# EAGLE design 201_3axisRev010100 (EAGLE 9.6.2)
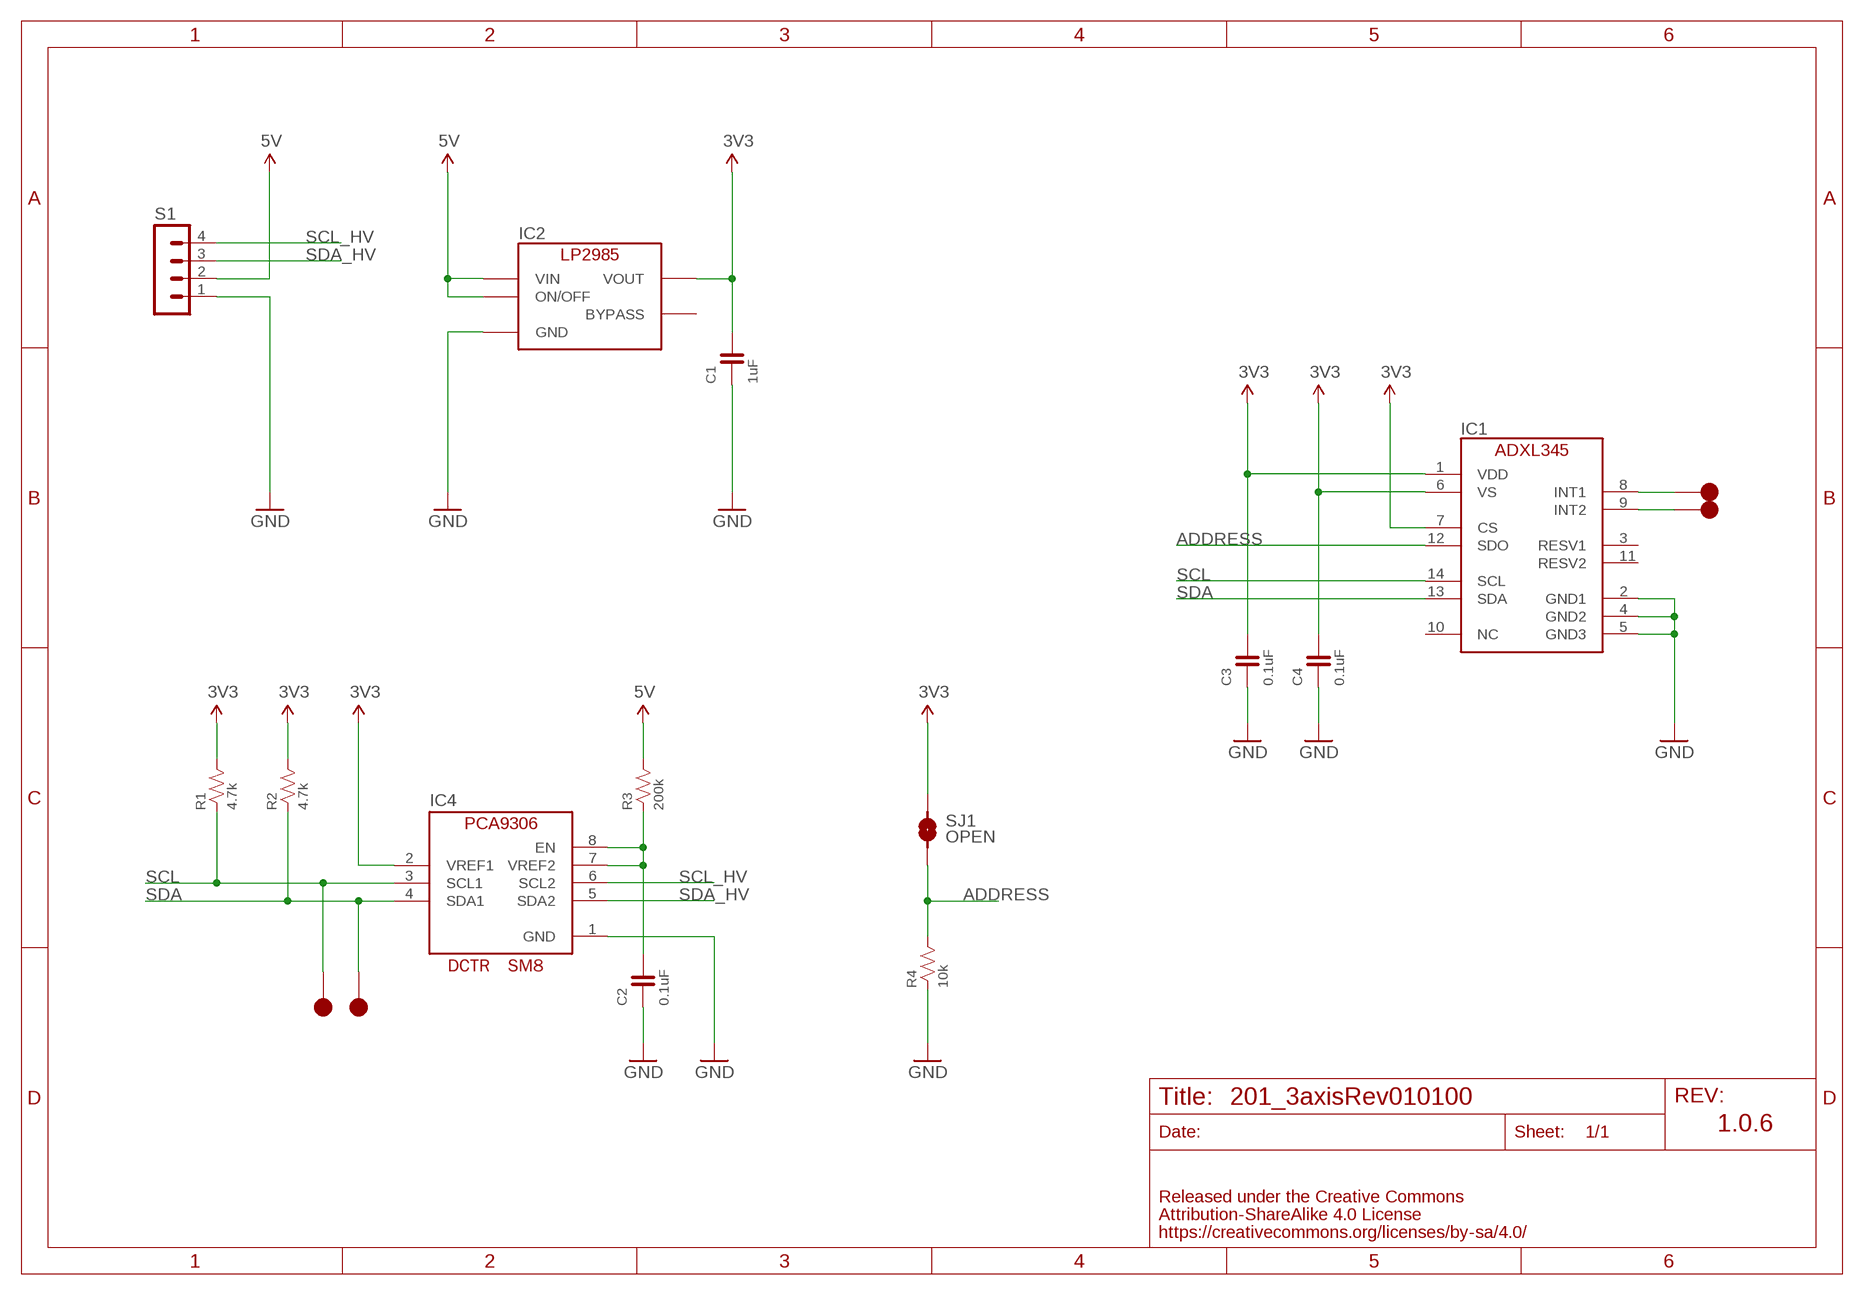
[diagram p0: schematic, sheet 1]

## Parts
C1  1uF  CAPACITOR-0603  [0603]
C2  0.1uF  CAPACITOR-0603  [0603]
C3  0.1uF  CAPACITOR-0603  [0603]
C4  0.1uF  CAPACITOR-0603  [0603]
IC1  AD-ADXL345  [ANALOGDEVICES-ADXL345]
IC2  LP2985-33DBV  [SOT-23-5]
IC4  PCA9306_SSOP  [8PIN-SSOP]
R1  4.7k  RESISTOR-0603  [0603]
R2  4.7k  RESISTOR-0603  [0603]
R3  200k  RESISTOR-0603  [0603]
R4  10k  RESISTOR-0603  [0603]
S1  MA04-1  [MA04-1]
SJ1  OPEN  SMD-JUMPER-2  [SMD-JUMPER-2]
TP1  TP-15  [TP-15]
TP2  TP-15  [TP-15]
TP3  TP-15  [TP-15]
TP4  TP-15  [TP-15]

## Nets
3V3: C1.2 C3.2 C4.2 IC1.1(VDD) IC1.6(VS) IC1.7(CS) IC2.5(VOUT) IC4.2(VREF1) R1.2 R2.2 SJ1.1
5V: IC2.1(VIN) IC2.3(ON/OFF) R3.2 S1.2
ADDRESS: IC1.12(SDO) R4.2 SJ1.2
GND: C1.1 C2.1 C3.1 C4.1 IC1.2(GND1) IC1.4(GND2) IC1.5(GND3) IC2.2(GND) IC4.1(GND) R4.1 S1.1
INT1: IC1.8(INT1) TP3.1
INT2: IC1.9(INT2) TP4.1
N$1: C2.2 IC4.7(VREF2) IC4.8(EN) R3.1
SCL: IC1.14(SCL) IC4.3(SCL1) R1.1 TP2.1
SCL_HV: IC4.6(SCL2) S1.4
SDA: IC1.13(SDA) IC4.4(SDA1) R2.1 TP1.1
SDA_HV: IC4.5(SDA2) S1.3
Unconnected: IC1.3(RESV1) IC1.10(NC) IC1.11(RESV2) IC2.4(BYPASS)

## Notes on the sheet
- DCTR　SM8
- 1.0.6

## Library data of the parts
C1-C4 = FaBo-Capacitor:CAPACITOR: CAPACITOR
IC1 = FaBo-Mems:AD-ADXL345: ANALOGDEVICES ADXL345(3axis)
IC2 = FaBo-Supply:LP2985: LP2985
IC4 = FaBo-LevelTranslator:PCA9306
R1-R4 = FaBo-Resistors:RESISTOR: RESISTOR
S1 = con-lstb:MA04-1: PIN HEADER; OC_FARNELL: unknown; OC_NEWARK: unknown
SJ1 = FaBo-etc:SMD-JUMPER-2
TP1-TP4 = FaBo-Supply:TP

## Board
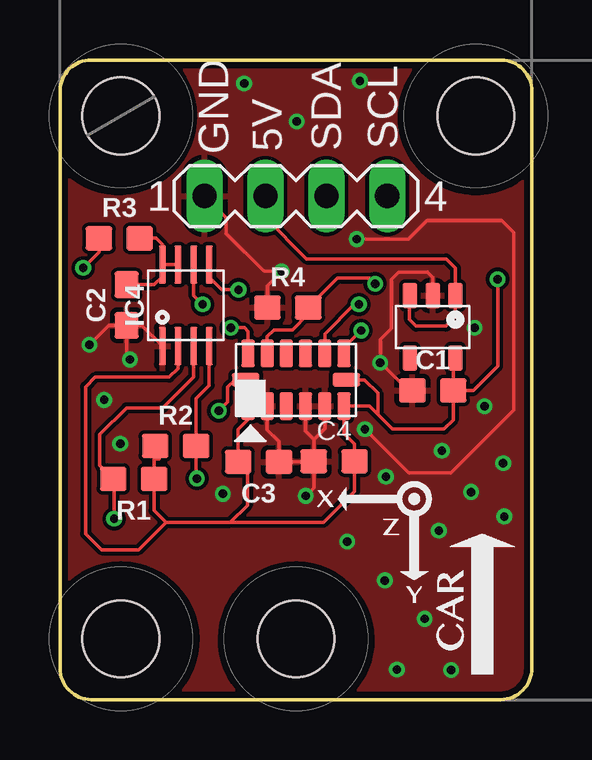
[diagram p1: board, top side]
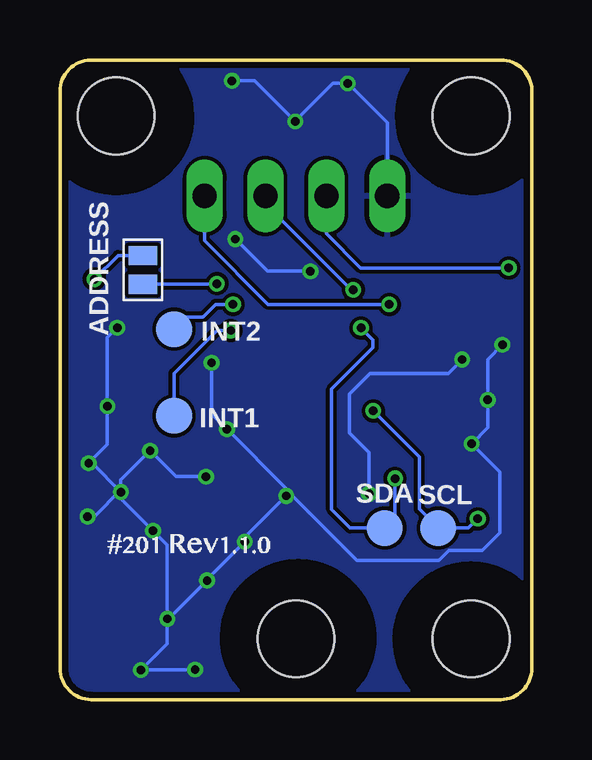
[diagram p2: board, bottom side, seen from below]

Size 19.68 x 26.67 mm. Coordinates in mm from the lower left corner, seen from the top.
Outline: 0,1.3 0,25.4 arc-88 1.3,26.67 18.41,26.67 arc-88 19.68,25.37 19.68,1.3 arc-88 18.39,0 1.3,0 arc-88 0,1.3
Copper layers (1*16): Top 0.035mm / dielectric 1.6mm / Bottom 0.035mm
Design rules "PCBway": minimum track width 6mil, minimum drill 12mil, track to track 6mil, track to pad 6mil, pad to pad 6mil, via to via 6mil, smd to smd 6mil, copper to edge 10mil, drill to drill 10mil, minimum pad ring 10mil, minimum via ring 6mil, stop-mask expansion 2mil, vias tented up to drill 100mil, thermal gap 8mil
Holes 3.2 mm at 2.54,2.54 17.34,24.34 2.54,24.34 9.84,2.54
tRestrict: 4 lines
bRestrict: 4 lines

### Footprints (pad centres in the part's own frame; a part is rotated, then mirrored left to right if it is on the bottom)
0603 = smd 1.1 x 1: 1 -0.85,0; 2 0.85,0
ANALOGDEVICES-ADXL345 = smd 1.145 x 0.55: 1 -1.097,2; 2 -1.097,1.2; 3 -1.097,0.4; 4 -1.097,-0.4; 5 -1.097,-1.2; 6 -1.097,-2; 8 1.097,-2; 9 1.097,-1.2; 10 1.097,-0.4; 11 1.097,0.4; 12 1.097,1.2; 13 1.097,2 | smd 0.55 x 1.145: 7 0,-2.098; 14 0,2.098
SOT-23-5 = smd 0.6 x 1.05: 1 -0.95,-1.3; 2 0,-1.3; 3 0.95,-1.3; 4 0.95,1.3; 5 -0.95,1.3
8PIN-SSOP = smd 0.3 x 1.6: 1 -0.975,-1.7; 2 -0.325,-1.7; 3 0.325,-1.7; 4 0.975,-1.7; 5 0.975,1.7; 6 0.325,1.7; 7 -0.325,1.7; 8 -0.975,1.7
MA04-1 = drill 1.016 long: 1 -3.81,0; 2 -1.27,0; 3 1.27,0; 4 3.81,0
SMD-JUMPER-2 = smd 0.8 x 1.2: 1 -0.6,0; 2 0.6,0
TP-15 = smd 1.5 x 1.5: 1 0,0

### Placement (x,y rotation side)
C1  15.55,12.88 0 top
C2  2.79,16.45 90 top
C3  8.29,9.91 180 top
C4  11.44,9.94 0 top
IC1  9.84,13.34 90 top
IC2  15.54,15.54 180 top
IC4  5.25,16.44 0 top
R1  3.08,9.21 0 top
R2  4.83,10.57 180 top
R3  2.48,19.23 180 top
R4  9.5,16.34 0 top
S1  9.84,21 0 top
SJ1  16.23,17.92 270 bottom
TP1  6.13,7.16 0 bottom
TP2  3.9,7.15 0 bottom
TP3  14.93,11.84 0 bottom
TP4  14.93,15.45 0 bottom

### Tracks (layer width: path | path; a pad name or v marks a point on that pad's centre or on a via)
3V3  (via drill 0.35)
  Top 0.152: R1.2 3.92,10.53 R2.2 | IC1.1 7.84,11.67 7.43,11.27 C3.2 7.82,9.53 7.82,8.11 7.1,7.39 | C1.2 16.4,14.15 IC2.5 | C1.2 16.4,11.66 16.02,11.28 13.86,11.28 13.25,11.89 | 13.25,11.89 12.9,12.24 IC1.6 11.84,11.11 12.29,10.66 C4.2 12.29,8.69 10.99,7.39 7.1,7.39 | IC1.7 12.7,13.34 13.25,12.78 13.25,11.89 | 4.14,10.03 3.92,10.03 R1.2 | R1.2 3.92,7.88 4.42,7.39 | 4.42,7.39 7.1,7.39 | IC4.2 4.92,13.81 4.56,13.45 1.48,13.45 1.07,13.04 1.07,6.91 1.73,6.25 3.28,6.25 4.42,7.39 | C1.2 17.23,12.88 18.25,13.9 v18.25,17.53
  Bottom 0.152: v18.25,17.53 17.26,18.52 SJ1.1
5V  (via drill 0.35)
  Top 0.152: S1.2 8.57,20.09 10.29,18.37 16.11,18.37 16.5,17.98 IC2.1 16.5,15.96 16.1,15.57 14.85,15.57 14.58,15.84 14.58,16.83 IC2.3 | 1.62,19.59 R3.2 1.62,18.66 v0.97,18
  Bottom 0.152: S1.2 8.57,19.42 7.15,18 v0.97,18
ADDRESS  (via drill 0.35)
  Top 0.152: v13.14,17.34 12.91,17.57 11.58,17.57 R4.2 10.35,16.07 9.7,15.42 8.92,15.42 8.64,15.14 IC1.12
  Bottom 0.152: v13.14,17.34 13.16,17.32 SJ1.2
GND  (via drill 0.35)
  Top 0.152: S1.1 6.93,20.1 6.93,19.43 8.5,17.86 v9.24,17.86 8.65,17.27 R4.1 | C4.1 | C4.1 10.59,10.86 | IC1.4 10.24,11.2 10.59,10.86 | IC1.2 8.64,11.25 9.13,10.76 C3.1 | IC1.5 11.04,11.31 10.59,10.86 | IC4.1 3.41,15.61 C2.1 | C3.1 10.55,9.91 C4.1 | C3.1 10.56,9.91 C4.1 | C4.1 10.59,8.83 v10.25,8.49 | C1.1 14.53,12.88 v13.36,14.05 13.36,15.01 13.82,15.47 13.82,17.52 14.13,17.83 15.32,17.83 15.54,17.61 IC2.2 | C2.1 2.79,14.31 v2.92,14.18 | v12.37,19.2 14.53,19.2 15.31,19.98 18.42,19.98 18.93,19.47 18.93,12.08 16.3,9.45 14.55,9.45 v12.72,11.28 | v1.23,14.8 2.04,15.61 C2.1
  Bottom 0.152: v10.25,8.49 10.25,8.81 v12.72,11.28 13.36,11.92 v13.36,14.05 | v9.24,17.86 11.03,17.86 v12.37,19.2 | v1.23,14.8 1.84,14.19 v1.84,12.5 1.84,11.34 v2.52,10.67 1.34,9.49 1.34,6.95 2.07,6.22 3.46,6.22 3.5,6.17 3.52,6.17 3.89,5.81 7.3,5.81 9.98,8.49 v10.25,8.49 | v10.25,8.49 11.98,6.76 v11.98,6.58 13.55,5.01 v13.55,4.97 15.15,3.37 v15.21,3.37 | v6.8,8.58 6.8,10.3 7.62,11.12 7.62,12.74 6.77,13.59 3.49,13.59 2.92,14.16 v2.92,14.18 | v14.05,1.25 16.29,1.25 v16.31,1.23 15.21,2.33 v15.21,3.37 | v15.21,3.37 15.21,6.45 v15.8,7.04 17.14,8.38 v17.14,8.66 | v17.14,8.66 17.14,8.73 | 17.14,8.73 17.14,9.16 v15.93,10.38 14.84,9.3 v13.59,9.3 | S1.1 6.03,24.05 v7.68,25.7 8.29,25.7 v9.88,24.11 11.57,25.8 v12.51,25.8 | v18.53,7.63 18.24,7.63 17.14,8.73 | v17.14,8.66 18.35,9.86 v18.49,9.86 17.71,10.64 v17.71,12.24 17.71,15.09 v17.3,15.5
  pour Bottom (rank 6): -1.26,28.57 21.11,28.57 21.11,-2.27 -1.26,-2.27
  pour Top (rank 6): -0.76,-1.59 -0.76,28.04 20.71,28.04 20.71,-1.59
INT1  (via drill 0.35)
  Top 0.152: IC1.8 11.84,14.67 v12.56,15.39
  Bottom 0.152: TP3.1 14.93,13.61 13.14,15.39 v12.56,15.39
INT2  (via drill 0.35)
  Top 0.152: IC1.9 11.04,15.25 12.27,16.48 v12.47,16.48
  Bottom 0.152: v12.47,16.48 13.2,16.48 13.72,15.96 14.41,15.96 TP4.1
N$1
  Top 0.152: C2.2 3.94,17.3 4.28,17.64 IC4.8 | IC4.8 4.28,18.98 4,19.25 3.34,19.25 R3.1 | IC4.7 IC4.8
SCL  (via drill 0.35)
  Top 0.152: IC4.3 5.58,13.46 4.28,12.16 2.77,12.16 1.66,11.05 1.66,9.77 R1.1 2.26,9.17 v2.26,7.54 | v6.62,12.04 6.99,12.41 6.99,13.03 7.29,13.34 IC1.14
  Bottom 0.152: v2.26,7.54 2.65,7.15 TP2.1 4.7,7.95 4.7,10.12 v6.62,12.04
SCL_HV  (via drill 0.35)
  Top 0.152: IC4.6 5.58,16.86 v5.95,16.48
  Bottom 0.152: v5.95,16.48 11,16.48 13.65,19.13 S1.4
SDA  (via drill 0.35)
  Top 0.152: 7.83,14.45 IC1.13 7.84,15.36 7.69,15.51 v7.14,15.51 v7.13,15.5 | IC4.4 6.22,13.11 5.67,12.55 R2.1 5.67,9.26 v5.71,9.22
  Bottom 0.152: v5.71,9.22 5.71,7.58 TP1.1 7.58,7.16 8.36,7.93 8.36,12.95 6.63,14.68 6.63,15 v7.13,15.5
SDA_HV  (via drill 0.35)
  Top 0.152: v7.45,17.09 6.73,17.09 6.21,17.61 6.21,18.12 IC4.5
  Bottom 0.152: S1.3 11.11,20.66 7.55,17.1 v7.46,17.1 v7.45,17.09

### Text on the board
tPlace: GND | 5V | SDA | SCL
bPlace: ADDRESS | INT2 | INT1 | SCL | SDA
tDocu: 201 3AXIS Revision 1.1.0 / 2023/07/26